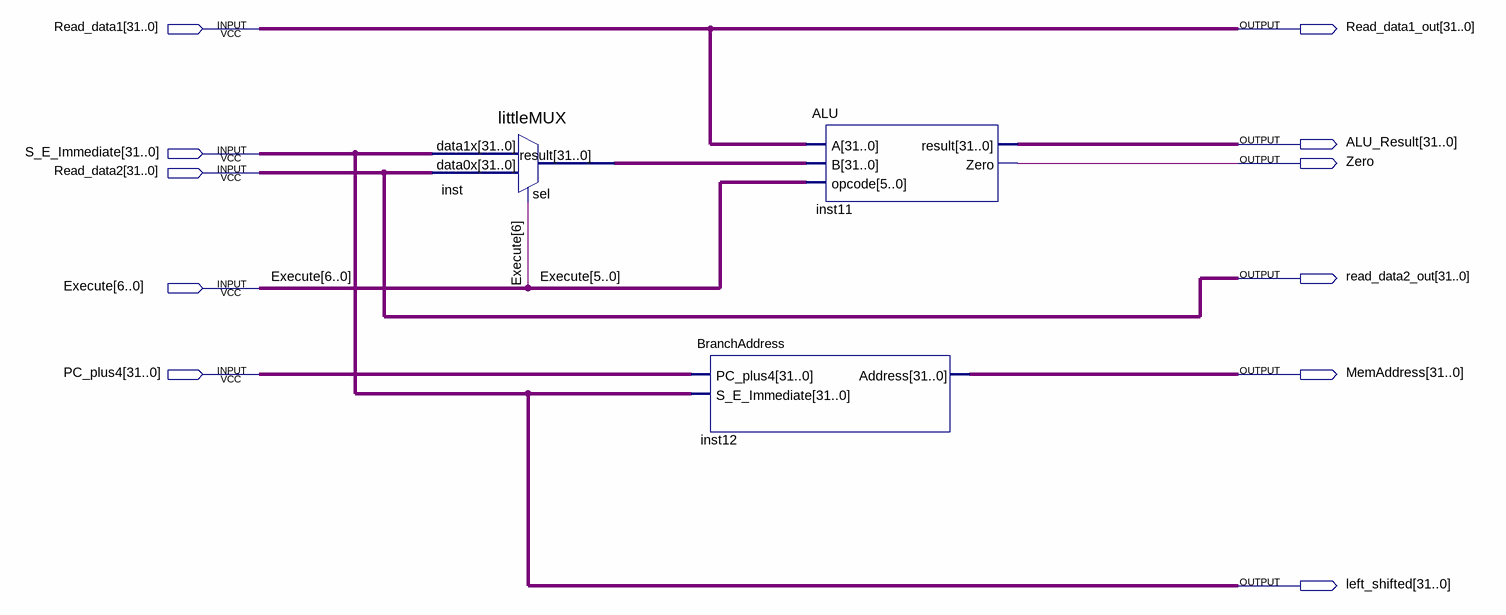
[diagram p0: schematic sheet]
// Quartus schematic ExecuteLevel.bdf as structural Verilog: 3 symbols, 11 pins
module ExecuteLevel (
  input  [31:0] Read_data1,
  input  [31:0] S_E_Immediate,
  input  [31:0] Read_data2,
  input  [6:0] Execute,
  input  [31:0] PC_plus4,
  output [31:0] Read_data1_out,
  output [31:0] ALU_Result,
  output Zero,
  output [31:0] read_data2_out,
  output [31:0] MemAddress,
  output [31:0] left_shifted
);

  wire [31:0] inst_result;

  littleMUX inst (.data1x(S_E_Immediate), .data0x(Read_data2), .sel(Execute[6]), .result(inst_result));
  BranchAddress inst12 (.PC_plus4(PC_plus4), .S_E_Immediate(S_E_Immediate), .Address(MemAddress));
  ALU inst11 (.A(Read_data1), .B(inst_result), .opcode(Execute[5:0]), .result(ALU_Result), .Zero(Zero));

  assign left_shifted = S_E_Immediate;
  assign Read_data1_out = Read_data1;
  assign read_data2_out = Read_data2;
endmodule
